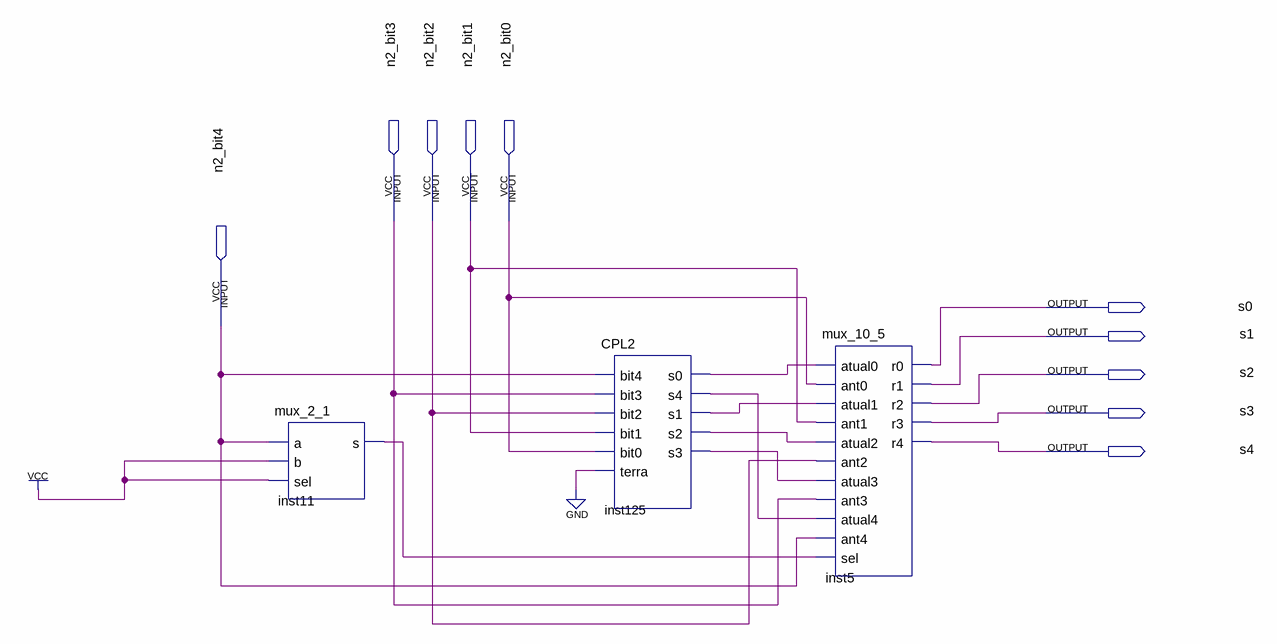
[diagram p0: schematic sheet]
// Quartus schematic modulo_5bits.bdf as structural Verilog: 3 symbols, 10 pins
module modulo_5bits (
  input  n2_bit3,
  input  n2_bit2,
  input  n2_bit1,
  input  n2_bit0,
  input  n2_bit4,
  output s0,
  output s1,
  output s2,
  output s3,
  output s4
);

  wire inst11_s, inst125_s0, inst125_s1, inst125_s2, inst125_s3, inst125_s4;

  mux_2_1 inst11 (.a(n2_bit4), .b(1'b1), .sel(1'b1), .s(inst11_s));
  CPL2 inst125 (
    .bit4(n2_bit4), .bit3(n2_bit3), .bit2(n2_bit2), .bit1(n2_bit1), .bit0(n2_bit0), .terra(1'b0),
    .s0(inst125_s0), .s4(inst125_s4), .s1(inst125_s1), .s2(inst125_s2), .s3(inst125_s3));
  mux_10_5 inst5 (
    .atual0(inst125_s0), .ant0(n2_bit0), .atual1(inst125_s1), .ant1(n2_bit1), .atual2(inst125_s2),
    .ant2(n2_bit2), .atual3(inst125_s3), .ant3(n2_bit3), .atual4(inst125_s4), .ant4(n2_bit4), .sel(inst11_s),
    .r0(s0), .r1(s1), .r2(s2), .r3(s3), .r4(s4));
endmodule
